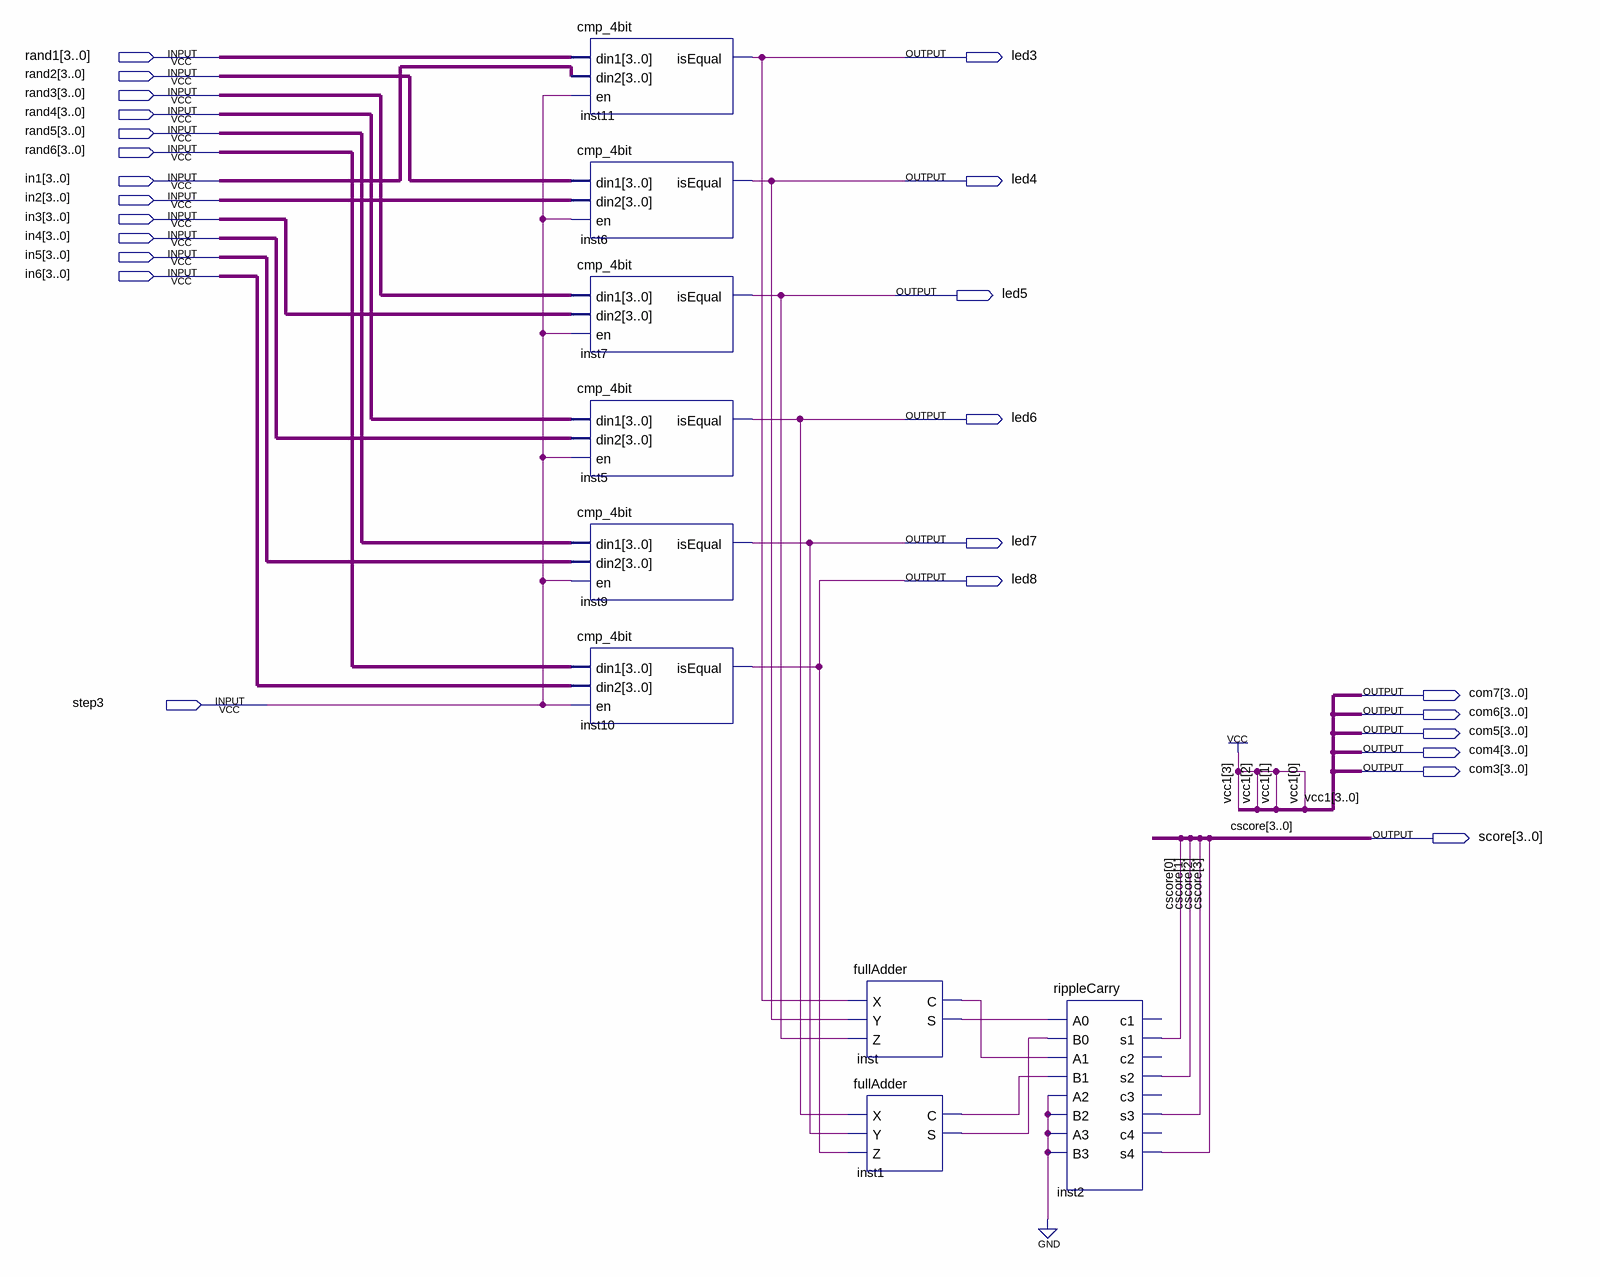
[diagram p0: schematic sheet]
// Quartus schematic stepThree.bdf as structural Verilog: 9 symbols, 25 pins
module stepThree (
  input  [3:0] rand1,
  input  [3:0] rand2,
  input  [3:0] rand3,
  input  [3:0] rand4,
  input  [3:0] rand5,
  input  [3:0] rand6,
  input  [3:0] in1,
  input  [3:0] in2,
  input  [3:0] in3,
  input  [3:0] in4,
  input  [3:0] in5,
  input  [3:0] in6,
  input  step3,
  output led3,
  output led4,
  output led5,
  output led6,
  output led7,
  output led8,
  output [3:0] com7,
  output [3:0] com6,
  output [3:0] com5,
  output [3:0] com4,
  output [3:0] com3,
  output [3:0] score
);

  wire inst1_c, inst1_s, inst_c, inst_s;

  cmp_4bit inst11 (.din1(rand1), .din2(in1), .en(step3), .isEqual(led3));
  cmp_4bit inst6 (.din1(rand2), .din2(in2), .en(step3), .isEqual(led4));
  cmp_4bit inst7 (.din1(rand3), .din2(in3), .en(step3), .isEqual(led5));
  cmp_4bit inst5 (.din1(rand4), .din2(in4), .en(step3), .isEqual(led6));
  cmp_4bit inst9 (.din1(rand5), .din2(in5), .en(step3), .isEqual(led7));
  cmp_4bit inst10 (.din1(rand6), .din2(in6), .en(step3), .isEqual(led8));
  fullAdder inst (.X(led3), .Y(led4), .Z(led5), .C(inst_c), .S(inst_s));
  fullAdder inst1 (.X(led6), .Y(led7), .Z(led8), .C(inst1_c), .S(inst1_s));
  rippleCarry inst2 (
    .A0(inst_s), .B0(inst1_s), .A1(inst_c), .B1(inst1_c), .A2(1'b0), .B2(1'b0), .A3(1'b0), .B3(1'b0),
    .s1(score[0]), .s2(score[1]), .s3(score[2]), .s4(score[3]));  // open: c1, c2, c3, c4

  assign com3 = 4'b1111;
  assign com4 = 4'b1111;
  assign com5 = 4'b1111;
  assign com6 = 4'b1111;
  assign com7 = 4'b1111;

  // Other names for the same wires on the sheet: cscore[3:0] = score
endmodule
